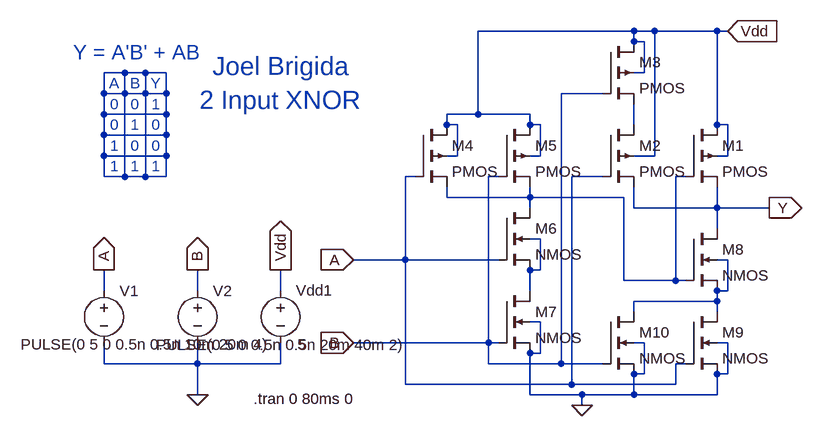
[diagram p0: schematic 2XNOR.asc]
2XNOR.asc, the LTspice schematic file:
Version 4
SHEET 1 880 680
WIRE 192 -112 -48 -112
WIRE 224 -112 192 -112
WIRE 320 -112 224 -112
WIRE 336 -112 320 -112
WIRE 192 -96 192 -112
WIRE 208 -96 192 -96
WIRE -592 -48 -624 -48
WIRE -560 -48 -592 -48
WIRE -528 -48 -560 -48
WIRE 208 -48 208 -96
WIRE 208 -48 192 -48
WIRE -624 -16 -624 -48
WIRE -592 -16 -592 -48
WIRE -592 -16 -624 -16
WIRE -560 -16 -560 -48
WIRE -560 -16 -592 -16
WIRE -528 -16 -528 -48
WIRE -528 -16 -560 -16
WIRE 144 -16 80 -16
WIRE -624 16 -624 -16
WIRE -528 16 -528 -16
WIRE -528 16 -624 16
WIRE -48 16 -48 -112
WIRE -48 16 -96 16
WIRE 32 16 -48 16
WIRE -96 32 -96 16
WIRE -80 32 -96 32
WIRE 32 32 32 16
WIRE 48 32 32 32
WIRE 192 32 192 0
WIRE 320 32 320 -112
WIRE 336 32 320 32
WIRE -624 48 -624 16
WIRE -528 48 -528 16
WIRE -528 48 -624 48
WIRE -624 80 -624 48
WIRE -528 80 -528 48
WIRE -528 80 -624 80
WIRE -80 80 -80 32
WIRE -80 80 -96 80
WIRE 48 80 48 32
WIRE 48 80 32 80
WIRE 224 80 224 -112
WIRE 224 80 192 80
WIRE 336 80 336 32
WIRE 336 80 320 80
WIRE -624 112 -624 80
WIRE -592 112 -592 -16
WIRE -592 112 -624 112
WIRE -560 112 -560 -16
WIRE -560 112 -592 112
WIRE -528 112 -528 80
WIRE -528 112 -560 112
WIRE -144 112 -160 112
WIRE -16 112 -32 112
WIRE 144 112 96 112
WIRE 272 112 256 112
WIRE -96 144 -96 128
WIRE 32 144 32 128
WIRE 32 144 -96 144
WIRE 176 144 32 144
WIRE 32 160 32 144
WIRE 192 160 192 128
WIRE 320 160 320 128
WIRE 320 160 192 160
WIRE 400 160 320 160
WIRE 320 192 320 160
WIRE 48 208 32 208
WIRE -160 240 -160 112
WIRE -160 240 -240 240
WIRE -16 240 -160 240
WIRE 336 240 320 240
WIRE 48 256 48 208
WIRE 48 256 32 256
WIRE 176 272 176 144
WIRE 256 272 256 112
WIRE 256 272 176 272
WIRE 272 272 256 272
WIRE -624 288 -624 256
WIRE -480 288 -480 256
WIRE -352 288 -352 256
WIRE 32 288 32 256
WIRE 336 288 336 240
WIRE 336 288 320 288
WIRE 320 304 320 288
WIRE 320 304 192 304
WIRE 192 320 192 304
WIRE 320 320 320 304
WIRE 48 336 32 336
WIRE -32 368 -32 112
WIRE -32 368 -240 368
WIRE -16 368 -32 368
WIRE 208 368 192 368
WIRE 336 368 320 368
WIRE 48 384 48 336
WIRE 48 384 32 384
WIRE -624 400 -624 368
WIRE -480 400 -480 368
WIRE -480 400 -624 400
WIRE -352 400 -352 368
WIRE -352 400 -480 400
WIRE -32 400 -32 368
WIRE 80 400 80 -16
WIRE 80 400 -32 400
WIRE 144 400 80 400
WIRE 272 400 256 400
WIRE 208 416 208 368
WIRE 208 416 192 416
WIRE 336 416 336 368
WIRE 336 416 320 416
WIRE -160 432 -160 240
WIRE 96 432 96 112
WIRE 96 432 -160 432
WIRE 256 432 256 400
WIRE 256 432 96 432
WIRE -480 448 -480 400
WIRE 32 448 32 384
WIRE 112 448 32 448
WIRE 192 448 192 416
WIRE 192 448 112 448
WIRE 320 448 320 416
WIRE 320 448 192 448
WIRE 112 464 112 448
FLAG 400 160 Y
IOPIN 400 160 Out
FLAG 336 -112 Vdd
IOPIN 336 -112 In
FLAG 112 464 0
FLAG -240 240 A
IOPIN -240 240 In
FLAG -240 368 B
IOPIN -240 368 In
FLAG -480 448 0
FLAG -352 256 Vdd
IOPIN -352 256 Out
FLAG -480 256 B
IOPIN -480 256 Out
FLAG -624 256 A
IOPIN -624 256 Out
SYMBOL pmos4 272 32 R0
SYMATTR InstName M1
SYMBOL pmos4 144 32 R0
SYMATTR InstName M2
SYMBOL pmos4 144 -96 R0
SYMATTR InstName M3
SYMBOL pmos4 -144 32 R0
SYMATTR InstName M4
SYMBOL pmos4 -16 32 R0
SYMATTR InstName M5
SYMBOL nmos4 -16 160 R0
SYMATTR InstName M6
SYMBOL nmos4 -16 288 R0
SYMATTR InstName M7
SYMBOL nmos4 272 192 R0
SYMATTR InstName M8
SYMBOL nmos4 272 320 R0
SYMATTR InstName M9
SYMBOL nmos4 144 320 R0
SYMATTR InstName M10
SYMBOL voltage -624 272 R0
WINDOW 3 -128 98 Left 2
WINDOW 123 0 0 Left 0
WINDOW 39 0 0 Left 0
SYMATTR InstName V1
SYMATTR Value PULSE(0 5 0 0.5n 0.5n 10m 20m 4)
SYMBOL voltage -480 272 R0
WINDOW 3 -64 99 Left 2
WINDOW 123 0 0 Left 0
WINDOW 39 0 0 Left 0
SYMATTR InstName V2
SYMATTR Value PULSE(0 5 0 0.5n 0.5n 20m 40m 2)
SYMBOL voltage -352 272 R0
WINDOW 0 24 15 Left 2
WINDOW 3 26 98 Left 2
WINDOW 123 0 0 Left 0
WINDOW 39 0 0 Left 0
SYMATTR InstName Vdd1
SYMATTR Value 5
TEXT -394 454 Left 2 !.tran 0 80ms 0
TEXT -576 -80 Center 3 ;Y = A'B' + AB
TEXT -608 -32 Center 2 ;A
TEXT -576 -32 Center 2 ;B
TEXT -544 -32 Center 2 ;Y
TEXT -608 96 Center 2 ;1
TEXT -608 64 Center 2 ;1
TEXT -576 32 Center 2 ;1
TEXT -576 96 Center 2 ;1
TEXT -544 0 Center 2 ;1
TEXT -544 96 Center 2 ;1
TEXT -544 32 Center 2 ;0
TEXT -576 0 Center 2 ;0
TEXT -608 0 Center 2 ;0
TEXT -608 32 Center 2 ;0
TEXT -576 64 Center 2 ;0
TEXT -544 64 Center 2 ;0
TEXT -352 -32 Center 4 ;Joel Brigida\n2 Input XNOR

The netlist it stands for:
* 2XNOR.asc
M1 Vdd N003 Y Vdd PMOS
M2 N002 A Y Vdd PMOS
M3 Vdd B N002 Vdd PMOS
M4 Vdd A N003 Vdd PMOS
M5 Vdd B N003 Vdd PMOS
M6 N003 A N004 N004 NMOS
M7 N004 B 0 0 NMOS
M8 Y N003 N005 N005 NMOS
M9 N005 A 0 0 NMOS
M10 N005 B 0 0 NMOS
V1 A 0 PULSE(0 5 0 0.5n 0.5n 10m 20m 4)
V2 B 0 PULSE(0 5 0 0.5n 0.5n 20m 40m 2)
Vdd1 Vdd 0 5
.model NMOS NMOS
.model PMOS PMOS
.lib standard.mos
.tran 0 80ms 0
* Y = A'B' + AB
* A
* B
* Y
* 1
* 1
* 1
* 1
* 1
* 1
* 0
* 0
* 0
* 0
* 0
* 0
* Joel Brigida
* 2 Input XNOR
.backanno
.end